# Altium schematic sheet loom-front-box.SchDoc
size 840 x 594 mm
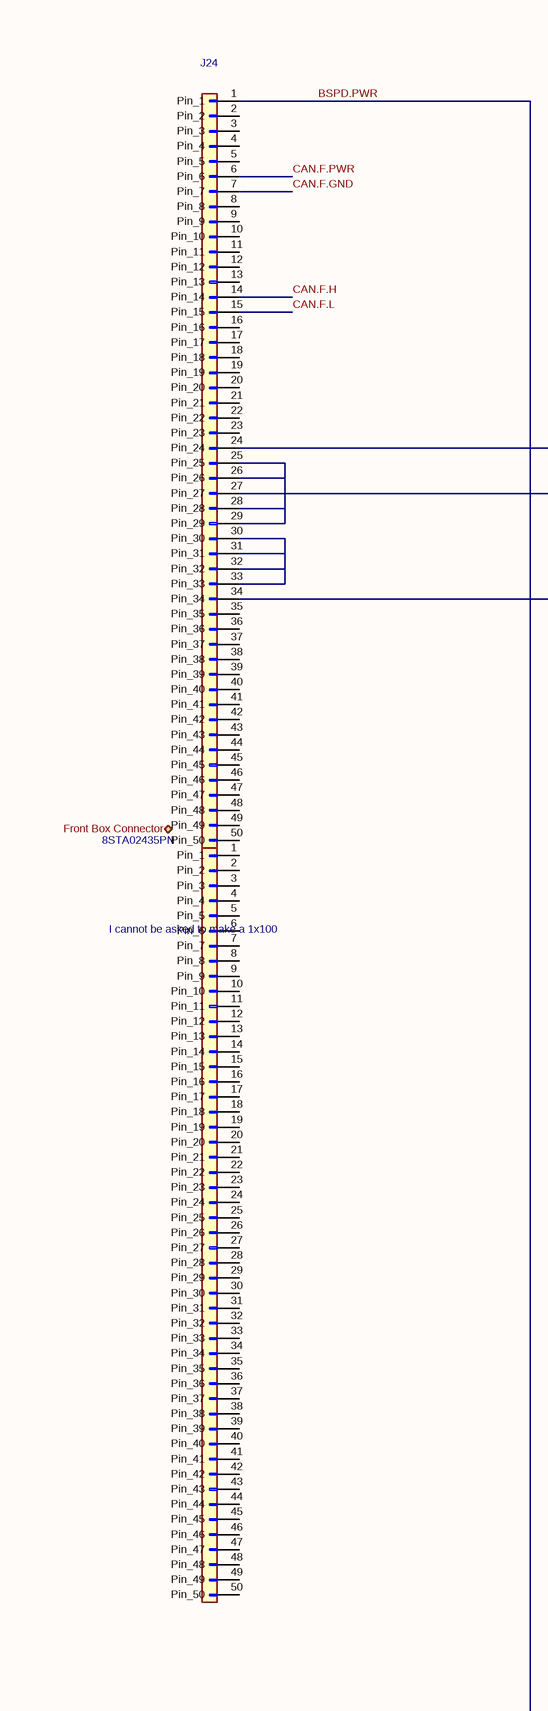
[diagram p0: loom-front-box.SchDoc, top middle]
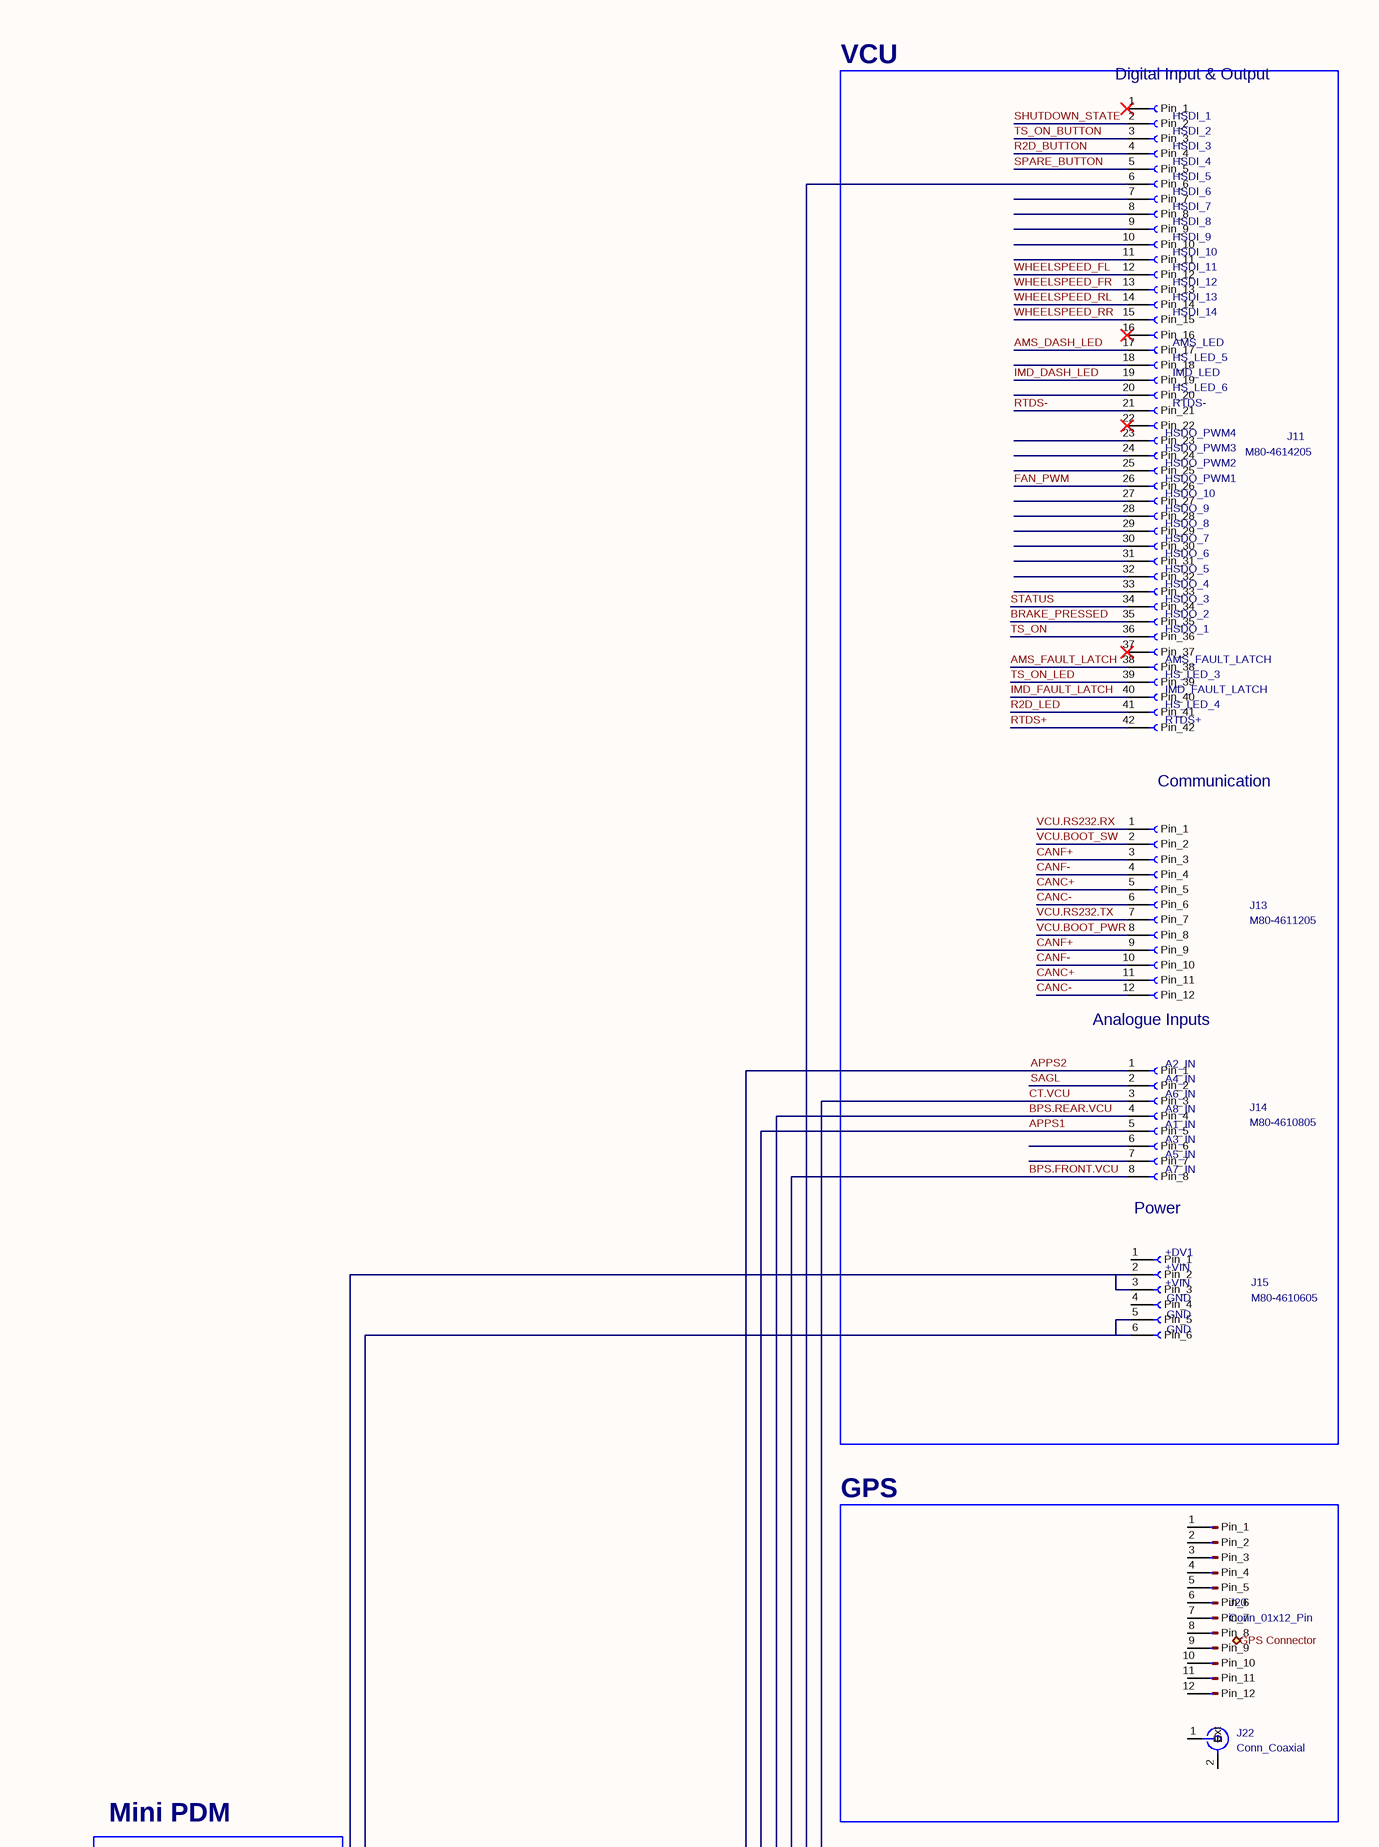
[diagram p1: loom-front-box.SchDoc, top right]
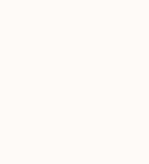
[diagram p2: loom-front-box.SchDoc, bottom left]
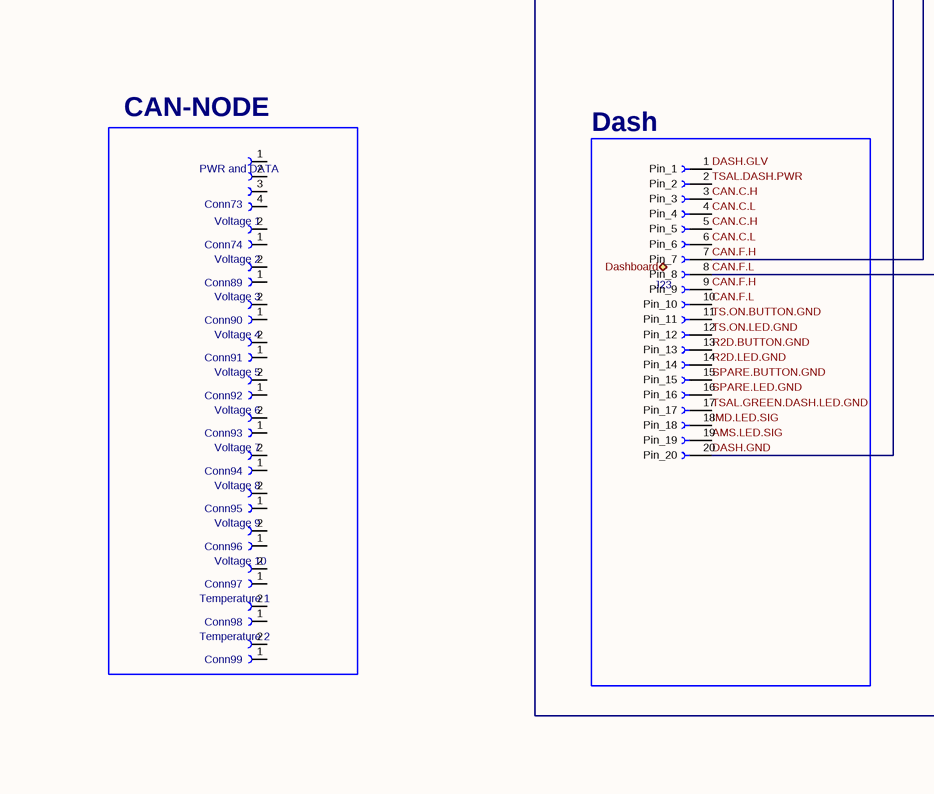
[diagram p3: loom-front-box.SchDoc, bottom middle]
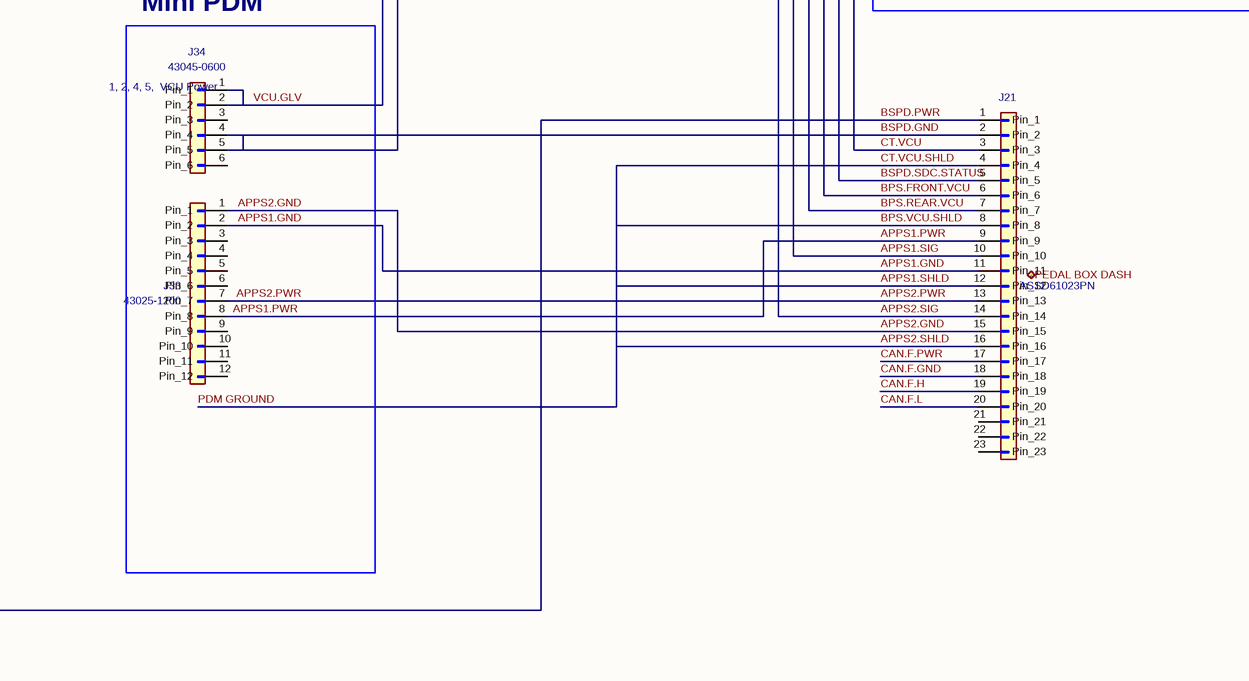
[diagram p4: loom-front-box.SchDoc, bottom right]

## Parts
Conn73  Molex_4x1S_Recepticle  (value not drawn)
Conn74  Molex_2x1S_Recepticle  (value not drawn)
Conn89  Molex_2x1S_Recepticle  (value not drawn)
Conn90  Molex_2x1S_Recepticle  (value not drawn)
Conn91  Molex_2x1S_Recepticle  (value not drawn)
Conn92  Molex_2x1S_Recepticle  (value not drawn)
Conn93  Molex_2x1S_Recepticle  (value not drawn)
Conn94  Molex_2x1S_Recepticle  (value not drawn)
Conn95  Molex_2x1S_Recepticle  (value not drawn)
Conn96  Molex_2x1S_Recepticle  (value not drawn)
Conn97  Molex_2x1S_Recepticle  (value not drawn)
Conn98  Molex_2x1S_Recepticle  (value not drawn)
Conn99  Molex_2x1S_Recepticle  (value not drawn)
J11  M80-4614205
J13  M80-4611205
J14  M80-4610805
J15  M80-4610605
J20  Conn_01x12_Pin
J21  ASSD61023PN
J22  Conn_Coaxial
J23  Conn_01x20_Socket  (value not drawn)
J24  8STA02435PN
J25  8STA02435PN  (value not drawn)
J33  43025-1200  [Molex_Micro-Fit_3.0_43045-1200_2x06_P3.00mm_Horizontal]
J34  43045-0600  [Molex_Micro-Fit_3.0_43045-0600_2x03_P3.00mm_Horizontal]

## Blocks framed on the sheet
VCU: J11 J13-J15
GPS: J20 J22
CAN-NODE /: Conn73 Conn74 Conn89-Conn99
Dash: J23
Mini PDM: J33 J34

## Ports
Dashboard (bidir), Front Box Connector (bidir), GPS Connector (bidir), PEDAL BOX DASH (bidir)

## Nets
AMS.LED.SIG: J23.19(Pin_19)
AMS_DASH_LED: J11.17(Pin_17)
AMS_FAULT_LATCH: J11.38(Pin_38)
APPS1: J14.5(Pin_5) J21.10(Pin_10)  [also labelled APPS1.SIG]
APPS1.GND: J21.11(Pin_11) J33.2(Pin_2)
APPS1.PWR: J21.9(Pin_9) J33.8(Pin_8)
APPS1.SHLD: J21.4(Pin_4) J21.8(Pin_8) J21.12(Pin_12) J21.16(Pin_16)  [also labelled APPS2.SHLD, BPS.VCU.SHLD, CT.VCU.SHLD, PDM GROUND]
APPS2: J14.1(Pin_1) J21.14(Pin_14)  [also labelled APPS2.SIG]
APPS2.GND: J21.15(Pin_15) J33.1(Pin_1)
APPS2.PWR: J21.13(Pin_13) J33.7(Pin_7)
BPS.FRONT.VCU: J14.8(Pin_8) J21.6(Pin_6)
BPS.REAR.VCU: J14.4(Pin_4) J21.7(Pin_7)
BRAKE_PRESSED: J11.35(Pin_35)
BSPD.GND: J15.5(Pin_5) J15.6(Pin_6) J21.2(Pin_2) J34.4(Pin_4) J34.5(Pin_5)
BSPD.PWR: J21.1(Pin_1) J24.1(Pin_1)
BSPD.SDC.STATUS: J11.6(Pin_6) J21.5(Pin_5)
CAN.C.H: J23.3(Pin_3) J23.5(Pin_5)
CAN.C.L: J23.4(Pin_4) J23.6(Pin_6)
CAN.F.GND: J21.18(Pin_18) J24.7(Pin_7)
CAN.F.H: J21.19(Pin_19) J23.7(Pin_7) J23.9(Pin_9) J24.14(Pin_14) J24.24(Pin_24)
CAN.F.L: J21.20(Pin_20) J23.8(Pin_8) J23.10(Pin_10) J24.15(Pin_15) J24.34(Pin_34)
CAN.F.PWR: J21.17(Pin_17) J24.6(Pin_6)
CANC+: J13.5(Pin_5) J13.11(Pin_11)
CANC-: J13.6(Pin_6) J13.12(Pin_12)
CANF+: J13.3(Pin_3) J13.9(Pin_9)
CANF-: J13.4(Pin_4) J13.10(Pin_10)
CT.VCU: J14.3(Pin_3) J21.3(Pin_3)
DASH.GLV: J23.1(Pin_1)
DASH.GND: J23.20(Pin_20) J24.25(Pin_25) J24.26(Pin_26) J24.27(Pin_27) J24.28(Pin_28) J24.29(Pin_29)
FAN_PWM: J11.26(Pin_26)
IMD.LED.SIG: J23.18(Pin_18)
IMD_DASH_LED: J11.19(Pin_19)
IMD_FAULT_LATCH: J11.40(Pin_40)
R2D.BUTTON.GND: J23.13(Pin_13)
R2D.LED.GND: J23.14(Pin_14)
R2D_BUTTON: J11.4(Pin_4)
R2D_LED: J11.41(Pin_41)
RTDS+: J11.42(Pin_42)
RTDS-: J11.21(Pin_21)
SAGL: J14.2(Pin_2)
SHUTDOWN_STATE: J11.2(Pin_2)
SPARE.BUTTON.GND: J23.15(Pin_15)
SPARE.LED.GND: J23.16(Pin_16)
SPARE_BUTTON: J11.5(Pin_5)
STATUS: J11.34(Pin_34)
TS.ON.BUTTON.GND: J23.11(Pin_11)
TS.ON.LED.GND: J23.12(Pin_12)
TS_ON: J11.36(Pin_36)
TS_ON_BUTTON: J11.3(Pin_3)
TS_ON_LED: J11.39(Pin_39)
TSAL.DASH.PWR: J23.2(Pin_2)
TSAL.GREEN.DASH.LED.GND: J23.17(Pin_17)
VCU.BOOT_PWR: J13.8(Pin_8)
VCU.BOOT_SW: J13.2(Pin_2)
VCU.GLV: J15.2(Pin_2) J15.3(Pin_3) J34.1(Pin_1) J34.2(Pin_2)
VCU.RS232.RX: J13.1(Pin_1)
VCU.RS232.TX: J13.7(Pin_7)
WHEELSPEED_FL: J11.12(Pin_12)
WHEELSPEED_FR: J11.13(Pin_13)
WHEELSPEED_RL: J11.14(Pin_14)
WHEELSPEED_RR: J11.15(Pin_15)
NetJ24_30: J24.30(Pin_30) J24.31(Pin_31) J24.32(Pin_32) J24.33(Pin_33)

Not connected (* = marked no-connect by the designer): Conn73 1 2 3 4; Conn74 1 2; Conn89 1 2; Conn90 1 2; Conn91 1 2; Conn92 1 2; Conn93 1 2; Conn94 1 2; Conn95 1 2; Conn96 1 2; Conn97 1 2; Conn98 1 2; Conn99 1 2; J11 1(Pin_1)* 7(Pin_7) 8(Pin_8) 9(Pin_9) 10(Pin_10) 11(Pin_11) 16(Pin_16)* 18(Pin_18) 20(Pin_20) 22(Pin_22)* 23(Pin_23) 24(Pin_24) 25(Pin_25) 27(Pin_27) 28(Pin_28) 29(Pin_29) 30(Pin_30) 31(Pin_31) 32(Pin_32) 33(Pin_33) 37(Pin_37)*; J14 6(Pin_6) 7(Pin_7); J15 1(Pin_1) 4(Pin_4); J20 1(Pin_1) 2(Pin_2) 3(Pin_3) 4(Pin_4) 5(Pin_5) 6(Pin_6) 7(Pin_7) 8(Pin_8) 9(Pin_9) 10(Pin_10) 11(Pin_11) 12(Pin_12); J21 21(Pin_21) 22(Pin_22) 23(Pin_23); J22 1(In) 2(Ext); J24 2(Pin_2) 3(Pin_3) 4(Pin_4) 5(Pin_5) 8(Pin_8) 9(Pin_9) 10(Pin_10) 11(Pin_11) 12(Pin_12) 13(Pin_13) 16(Pin_16) 17(Pin_17) 18(Pin_18) 19(Pin_19) 20(Pin_20) 21(Pin_21) 22(Pin_22) 23(Pin_23) 35(Pin_35) 36(Pin_36) 37(Pin_37) 38(Pin_38) 39(Pin_39) 40(Pin_40) 41(Pin_41) 42(Pin_42) 43(Pin_43) 44(Pin_44) 45(Pin_45) 46(Pin_46) 47(Pin_47) 48(Pin_48) 49(Pin_49) 50(Pin_50); J25 1(Pin_1) 2(Pin_2) 3(Pin_3) 4(Pin_4) 5(Pin_5) 6(Pin_6) 7(Pin_7) 8(Pin_8) 9(Pin_9) 10(Pin_10) 11(Pin_11) 12(Pin_12) 13(Pin_13) 14(Pin_14) 15(Pin_15) 16(Pin_16) 17(Pin_17) 18(Pin_18) 19(Pin_19) 20(Pin_20) 21(Pin_21) 22(Pin_22) 23(Pin_23) 24(Pin_24) 25(Pin_25) 26(Pin_26) 27(Pin_27) 28(Pin_28) 29(Pin_29) 30(Pin_30) 31(Pin_31) 32(Pin_32) 33(Pin_33) 34(Pin_34) 35(Pin_35) 36(Pin_36) 37(Pin_37) 38(Pin_38) 39(Pin_39) 40(Pin_40) 41(Pin_41) 42(Pin_42) 43(Pin_43) 44(Pin_44) 45(Pin_45) 46(Pin_46) 47(Pin_47) 48(Pin_48) 49(Pin_49) 50(Pin_50); J33 3(Pin_3) 4(Pin_4) 5(Pin_5) 6(Pin_6) 9(Pin_9) 10(Pin_10) 11(Pin_11) 12(Pin_12); J34 3(Pin_3) 6(Pin_6)

## Notes on the sheet
- (near J11) Digital Input & Output
- (near J11) HSDI_4
- (near J11) HSDI_3
- (near J11) HSDI_2
- (near J11) HSDI_1
- (near J11) HSDI_8
- (near J11) HSDI_5
- (near J11) HSDI_6
- (near J11) HSDI_7
- (near J11) HSDI_9
- (near J11) HSDI_13
- (near J11) HSDI_14
- (near J11) HSDI_10
- (near J11) HSDI_11
- (near J11) HSDI_12
- (near J11) IMD_LED
- (near J11) HS_LED_6
- (near J11) AMS_LED
- (near J11) HS_LED_5
- (near J11) HSDO_PWM4
- (near J11) HSDO_PWM3
- (near J11) HSDO_PWM2
- (near J11) RTDS-
- (near J11) HSDO_PWM1
- (near J11) HSDO_8
- (near J11) HSDO_7
- (near J11) HSDO_9
- (near J11) HSDO_10
- (near J11) HSDO_5
- (near J11) HSDO_4
- (near J11) HSDO_2
- (near J11) HSDO_6
- (near J11) HSDO_3
- (near J11) AMS_FAULT_LATCH
- (near J11) HS_LED_3
- (near J11) HSDO_1
- (near J11) IMD_FAULT_LATCH
- (near J11) HS_LED_4
- (near J11) RTDS+
- Communication
- (near J25) I cannot be asked
  to make a 1x100
- (near J13) Analogue Inputs
- (near J14) A2_IN
- (near J14) A4_IN
- (near J14) A1_IN
- (near J14) A6_IN
- (near J14) A3_IN
- (near J14) A8_IN
- Power
- (near J14) A5_IN
- (near J14) A7_IN
- (near J15) +VIN
- (near J15) +DV1
- (near J15) GND
- (near Conn73) PWR and DATA
- (near J34) 1, 2,
  4, 5,
  VCU Power
- (near Conn74) Voltage 1
- (near Conn89) Voltage 2
- (near Conn90) Voltage 3
- (near Conn91) Voltage 4
- (near Conn92) Voltage 5
- (near Conn93) Voltage 6
- (near Conn94) Voltage 7
- (near Conn95) Voltage 8
- (near Conn97) Voltage 10
- (near Conn96) Voltage 9
- (near Conn98) Temperature 1
- (near Conn99) Temperature 2
- 1
- 2
- 3
- 4
- 5
- 6
- 7
- 8
- 9
- 10
- 11
- 12
- 13
- 14
- 15
- 16
- A
- B
- C
- D
- E
- F
- G
- H
- I
- J
- K
- Title: Front Box
- File: loom-front-box.kicad_sch
- Sheet: /
- KiCad E.D.A.  kicad (5.1.4)-1
- Size: A1
- Date:
- Rev:
- Id: 1/1

## Library data of the parts
Conn73 = Molex_4x1S_Recepticle: P/N: 43645-0400; Value: Molex_4x1S_Recepticle
Conn74 Conn89-Conn99 = Molex_2x1S_Recepticle: P/N: 43645-0200; Value: Molex_2x1S_Recepticle
J11 = Conn_01x42_Socket: Description: "Generic connector, single row, 01x42, script generated"; Value: M80-4614205
J13 = Conn_01x12_Socket: Description: Generic connector, single row, 01x12, script generated; Value: M80-4611205
J14 = Conn_01x08_Socket: Description: Generic connector, single row, 01x08, script generated; Value: M80-4610805
J15 = Conn_01x06_Socket: Description: Generic connector, single row, 01x06, script generated; Value: M80-4610605
J20 = Conn_01x12_Pin: Description: Generic connector, single row, 01x12, script generated; Value: Conn_01x12_Pin
J21 = Conn_01x23: Description: Generic connector, single row, 01x23, script generated (kicad-library-utils/schlib/autogen/connector/); Value: ASSD61023PN
J22 = Conn_Coaxial: Description: coaxial connector (BNC, SMA, SMB, SMC, Cinch/RCA, LEMO, ...); Value: Conn_Coaxial
J23 = Conn_01x20_Socket: Description: Generic connector, single row, 01x20, script generated; Value: Conn_01x20_Socket
J24 J25 = Conn_01x50: Description: "Generic connector, single row, 01x50, script generated"; Value: 8STA02435PN
J33 = Conn_01x12: Description: Generic connector, single row, 01x12, script generated (kicad-library-utils/schlib/autogen/connector/); To Order: INV; Value: 43025-1200; Footprint: Connector_Molex:Molex_Micro-Fit_3.0_43045-1200_2x06_P3.00mm_Horizontal
J34 = Conn_01x06: Description: Generic connector, single row, 01x06, script generated (kicad-library-utils/schlib/autogen/connector/); To Order: INV; Value: 43045-0600; Footprint: Connector_Molex:Molex_Micro-Fit_3.0_43045-0600_2x03_P3.00mm_Horizontal